# EAGLE design head-board (EAGLE 9.5.1)
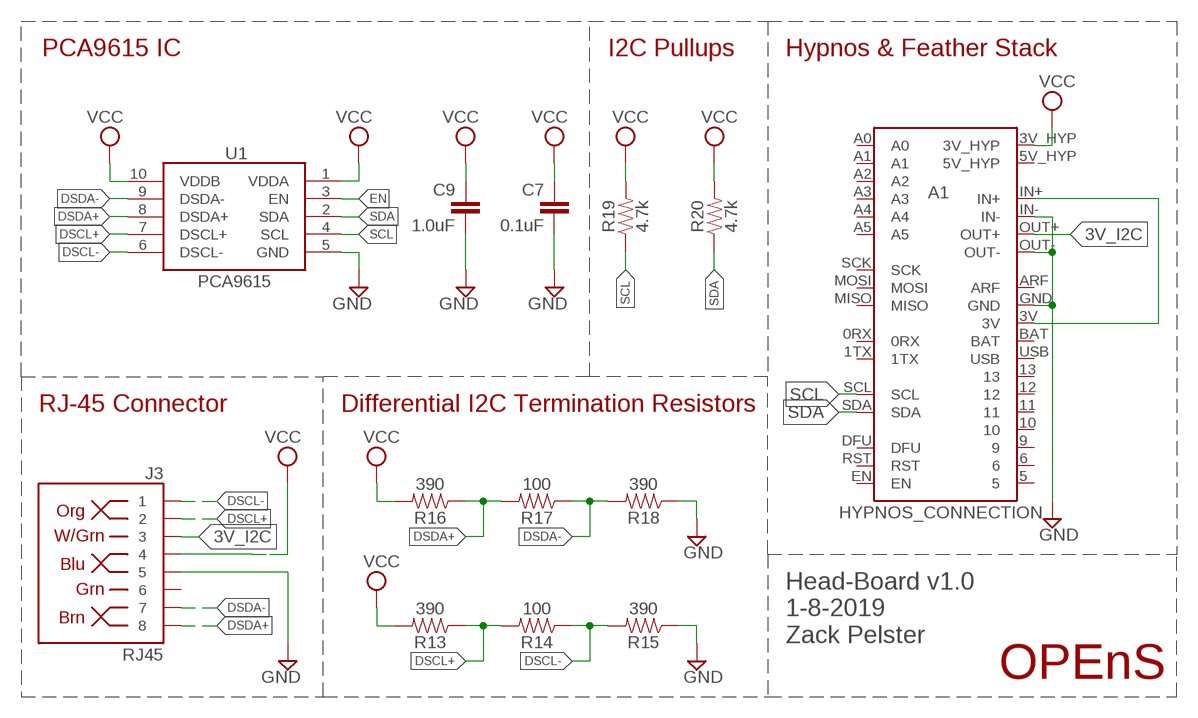
[diagram p0: schematic, sheet 1]

## Parts
A1  HYPNOS_CONNECTION  [HYPNOS_CONNECTION]
C7  0.1uF  0.1UF-0603-25V-(+80/-20%)  [0603]
C9  1.0uF  1.0UF-0603-16V-10%  [0603]
J3  RJ45  RJ45-8  [RJ45-8]
R13  390  390OHM-0603-1/10W-1%  [0603]
R14  100  100OHM-0603-1/10W-1%  [0603]
R15  390  390OHM-0603-1/10W-1%  [0603]
R16  390  390OHM-0603-1/10W-1%  [0603]
R17  100  100OHM-0603-1/10W-1%  [0603]
R18  390  390OHM-0603-1/10W-1%  [0603]
R19  4.7k  4.7KOHM-0603-1/10W-1%  [0603]
R20  4.7k  4.7KOHM-0603-1/10W-1%  [0603]
U1  PCA9615  [TSSOP10]
U$1  OPENS-LOGO  [OPENS-LOGO]

## Nets
3V_I2C: A1.OUT+ J3.3
DSCL+: J3.2 R13.1 R14.2 U1.7(DSCL+)
DSCL-: J3.1 R14.1 R15.2 U1.6(DSCL-)
DSDA+: J3.8 R16.1 R17.2 U1.8(DSDA+)
DSDA-: J3.7 R17.1 R18.2 U1.9(DSDA-)
EN: U1.3(EN)
GND: A1.GND A1.IN- A1.OUT- C7.2 C9.2 J3.5 R15.1 R18.1 U1.5(GND)
N$1: A1.3V A1.IN+
SCL: A1.SCL R19.1 U1.4(SCL)
SDA: A1.SDA R20.1 U1.2(SDA)
VCC: A1.3V_HYP C7.1 C9.1 J3.4 R13.2 R16.2 R19.2 R20.2 U1.1(VDDA) U1.10(VDDB)
Unconnected: A1.0RX A1.1TX A1.5 A1.5V_HYP A1.6 A1.9 A1.10 A1.11 A1.12 A1.13 A1.A0 A1.A1 A1.A2 A1.A3 A1.A4 A1.A5 A1.ARF A1.DFU A1.EN A1.MISO A1.MOSI A1.RST A1.SCK J3.6

## Notes on the sheet
- PCA9615 IC | I2C Pullups | Hypnos & Feather Stack
- RJ-45 Connector | Differential I2C Termination Resistors
- Head-Board v1.0
  1-8-2019
  Zack Pelster

## Power pins joined to a net without a drawn wire
BAT: A1.BAT
USB: A1.USB

## Library data of the parts
A1 = PNNL_Probe:HYPNOS_CONNECTION
C7 = SparkFun-Capacitors:0.1UF: 0.1µF ceramic capacitors A capacitor is a passive two-terminal electrical component used to store electrical energy temporarily in an electric field.; PROD_ID: CAP-00810
C9 = SparkFun-Capacitors:1.0UF: 1µF ceramic capacitors A capacitor is a passive two-terminal electrical component used to store electrical energy temporarily in an electric field.; PROD_ID: CAP-00868
J3 = SparkFun-Connectors:RJ45-8: RJ45 Jack - 8 pin Simple RJ45, 8-pin connection. Commonly used for Cat5, Cat5e, and Cat6 Ethernet cables. Here is the connector we sell at SparkFun: RJ45 8-Pin Connector <https://www.sparkfun.com/products/643> (PRT-00643) Datasheet <https://cdn.sparkfun.com/datasheets/Prototyping/04908.pdf> It is used on this SparkFun product: SparkFun RJ45 Breakout <https://www.sparkfun.com/products/716> (BOB-00716) Note, you may also be interested in the "MAGJACK" version of this. It is basically a RJ45 connector, but also has some status LEDs built into the connector housing. You can check that out in this library at the device named "MAGJACK.dev" and see these products online: RJ45 Ethernet MagJack-Compatible <https://www.sparkfun.com/products/8534> (PRT-08534) SparkFun RJ45 MagJack Breakout <https://www.sparkfun.com/products/13021> (BOB-13021); PROD_ID: CONN-08506; SF_ID: PRT-00643
R13 R15 R16 R18 = SparkFun-Resistors:390OHM: 390Ω resistor A resistor is a passive two-terminal electrical component that implements electrical resistance as a circuit element. Resistors act to reduce current flow, and, at the same time, act to lower voltage levels within circuits. - Wikipedia; PROD_ID: RES-07864
R14 R17 = SparkFun-Resistors:100OHM: 100Ω resistor A resistor is a passive two-terminal electrical component that implements electrical resistance as a circuit element. Resistors act to reduce current flow, and, at the same time, act to lower voltage levels within circuits. - Wikipedia; PROD_ID: RES-07863
R19 R20 = SparkFun-Resistors:4.7KOHM: 4.7kΩ resistor A resistor is a passive two-terminal electrical component that implements electrical resistance as a circuit element. Resistors act to reduce current flow, and, at the same time, act to lower voltage levels within circuits. - Wikipedia; PROD_ID: RES-07857
U1 = SparkFun-IC-Comms:PCA9615: Differential I2C Bus Buffer Datasheet <https://www.nxp.com/docs/en/data-sheet/PCA9615.pdf>; PROD_ID: IC-13899
U$1 = opens-logo:OPENS-LOGO: OPENS Lab Logo

## Net classes
0 default: width 0.305 mm

## Board
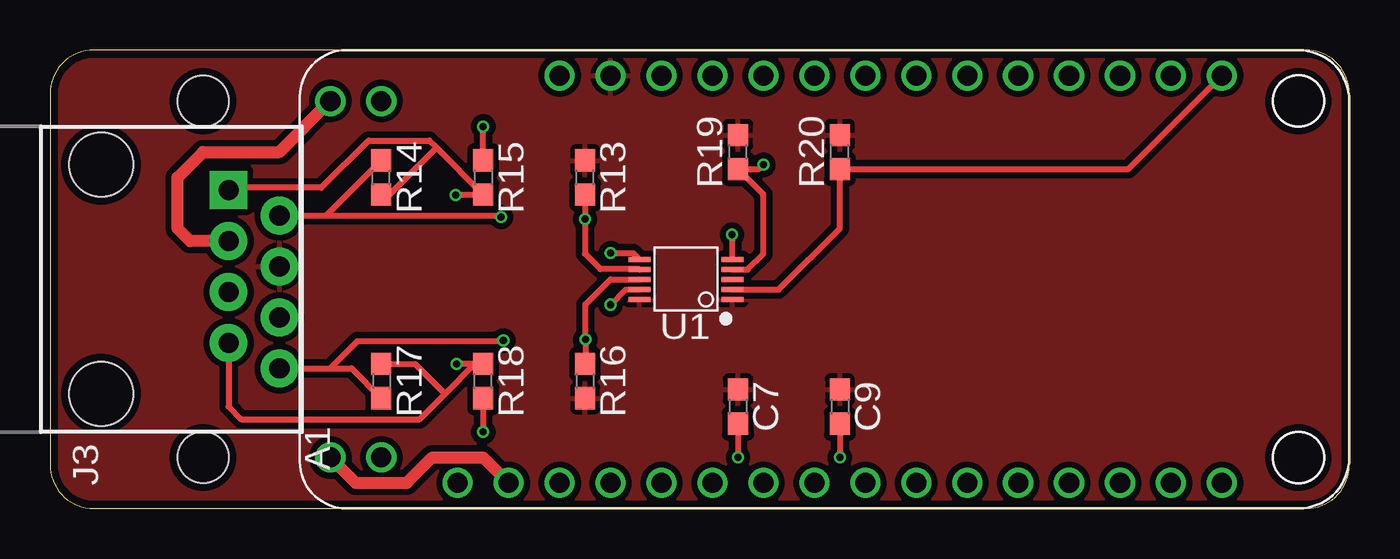
[diagram p1: board, top side]
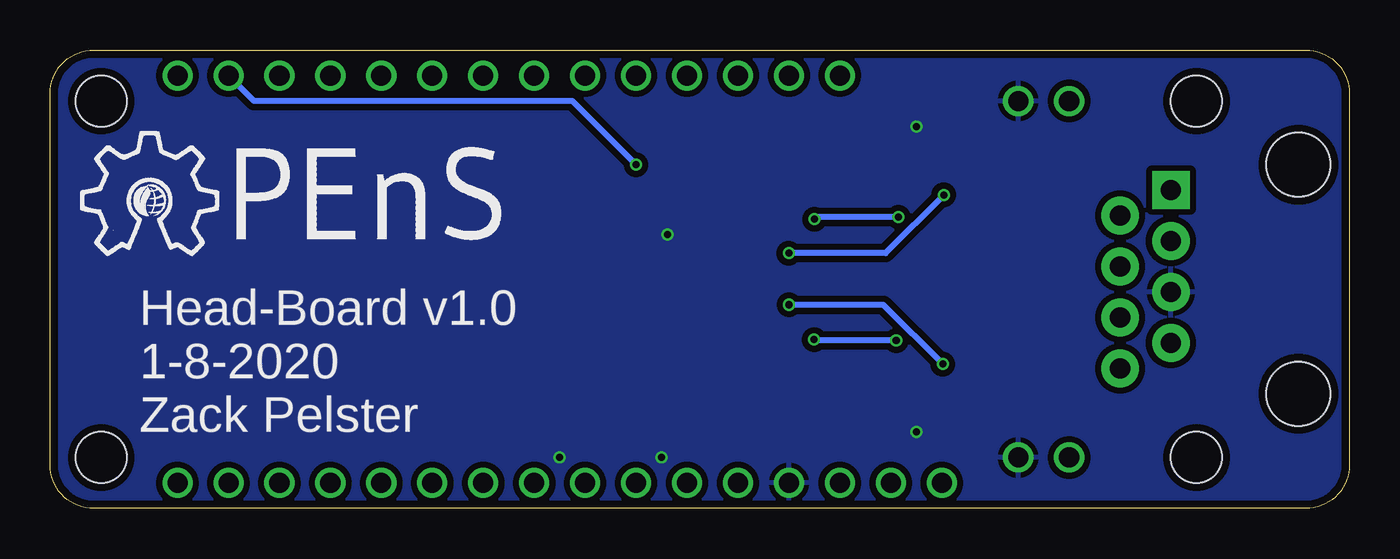
[diagram p2: board, bottom side, seen from below]

Size 64.77 x 22.86 mm. Coordinates in mm from the lower left corner, seen from the top.
Outline: 62.6,22.86 2.17,22.86 arc90 0,20.69 0,2.17 arc90 2.17,0 62.6,0 arc90 64.77,2.17 64.77,20.69 arc90 62.6,22.86
Copper layers (1*16): Top 0.035559375mm / dielectric 1.6mm / Bottom 0.035559375mm
Design rules "oshpark-2layer": minimum track width 6mil, minimum drill 10mil, track to track 6mil, track to pad 6mil, pad to pad 6mil, via to via 6mil, smd to smd 6mil, copper to edge 15mil, drill to drill 6mil, minimum pad ring 5mil, minimum via ring 5mil, stop-mask expansion 2.5mil, vias tented up to drill 0mil, thermal gap 10mil
Holes 2.54 mm at 7.62,20.32 7.62,2.54 62.23,2.54 62.23,20.32

### Footprints (pad centres in the part's own frame; a part is rotated, then mirrored left to right if it is on the bottom)
HYPNOS_CONNECTION = drill 1: 0RX 39.37,1.27; 1TX 41.91,1.27; 3V 8.89,1.27; 3V_HYP 13.97,21.59; 5 39.37,21.59; 5V_HYP 11.43,21.59; 6 36.83,21.59; 9 34.29,21.59; 10 31.75,21.59; 11 29.21,21.59; 12 26.67,21.59; 13 24.13,21.59; A0 16.51,1.27; A1 19.05,1.27; A2 21.59,1.27; A3 24.13,1.27; A4 26.67,1.27; A5 29.21,1.27; ARF 11.43,1.27; BAT 16.51,21.59; DFU 44.45,1.27; EN 19.05,21.59; GND 13.97,1.27; IN+ 0,2.54; IN- 2.54,2.54; MISO 36.83,1.27; MOSI 34.29,1.27; OUT+ 0,20.32; OUT- 2.54,20.32; RST 6.35,1.27; SCK 31.75,1.27; SCL 41.91,21.59; SDA 44.45,21.59; USB 21.59,21.59
0603 = smd 1.1 x 1: 1 -0.85,0; 2 0.85,0
RJ45-8 = drill 1 pad 1.88 square: 1 -4.445,6.35 | drill 1 pad 1.88: 2 -3.175,8.89; 3 -1.905,6.35; 4 -0.635,8.89; 5 0.635,6.35; 6 1.905,8.89; 7 3.175,6.35; 8 4.445,8.89 | hole 3.2: -5.715,0; 5.715,0
TSSOP10 = smd 1.1 x 0.25: 1 -2.259,1.018; 2 -2.259,0.517; 3 -2.259,0.018; 4 -2.259,-0.482; 5 -2.259,-0.988; 6 2.366,-0.988; 7 2.366,-0.482; 8 2.366,0.018; 9 2.366,0.517; 10 2.366,1.018

### Placement (x,y rotation side)
A1  13.97,0 0 top
C7  34.29,5.08 270 top
C9  39.37,5.08 270 top
J3  2.54,11.43 270 top
R13  26.67,16.51 90 top
R14  16.51,16.51 90 top
R15  21.59,16.51 270 top
R16  26.67,6.35 270 top
R17  16.51,6.35 270 top
R18  21.59,6.35 90 top
R19  34.29,17.78 90 top
R20  39.37,17.78 90 top
U1  31.75,11.43 180 top
U$1  63.5,8.89 0 bottom

### Tracks (layer width: path | path; a pad name or v marks a point on that pad's centre or on a via)
3V_I2C
  Top 0.61: J3.3 6.99,13.34 6.35,13.97 6.35,16.51 7.62,17.78 11.43,17.78 A1.OUT+
DSCL+  (via drill 0.35)
  Top 0.305: J3.2 13.76,14.61 13.77,14.62 | 13.77,14.62 R14.2 | R13.1 v26.66,14.43 26.66,12.71 27.44,11.93 29.36,11.93 U1.7 | v22.48,14.54 22.4,14.62 13.77,14.62
  Bottom 0.305: v22.48,14.54 26.56,14.54 v26.66,14.43
DSCL-  (via drill 0.35)
  Top 0.305: J3.1 9.01,15.99 13.52,15.99 15.88,18.36 18.89,18.36 19.26,17.99 | 19.26,17.99 R15.2 20.24,15.66 v20.22,15.63 | R14.1 16.93,15.66 19.26,17.99 | v27.94,12.73 29.07,12.73 U1.6
  Bottom 0.305: v20.22,15.63 23.12,12.73 v27.94,12.73
DSDA+  (via drill 0.35)
  Top 0.305: J3.8 13.97,6.99 | 13.97,6.99 15.03,6.99 R17.2 | 13.97,6.99 15.33,8.34 22.56,8.34 v22.59,8.37 | R16.1 26.69,7.21 v26.69,8.42 26.69,10.18 27.94,11.43 29.37,11.43 U1.8
  Bottom 0.305: v22.59,8.37 26.63,8.37 v26.69,8.42
DSDA-  (via drill 0.35)
  Top 0.305: J3.7 8.89,5.08 9.53,4.45 18.41,4.45 19.69,5.71 | 19.69,5.71 21.17,7.2 R18.2 v20.27,7.2 | R17.1 18.2,7.2 19.69,5.71 | v27.94,10.16 28.69,10.91 U1.9
  Bottom 0.305: v27.94,10.16 23.23,10.16 v20.27,7.2
GND  (via drill 0.35)
  Top 0.305: R15.1 v21.59,19.05 | R18.1 v21.59,3.81 | C7.2 v34.29,2.54 | C9.2 v39.37,2.54 | U1.5 v34.01,13.67 v34,13.66
  pour Bottom (isolate 0.305): -2.54,25.4 -2.54,-2.54 67.31,-2.54 67.31,25.4
N$1
  Top 0.61: A1.IN+ 15.24,1.27 17.78,1.27 19.05,2.54 21.59,2.54 A1.3V
SCL  (via drill 0.35)
  Top 0.305: U1.4 34.77,11.91 35.56,12.7 35.56,15.66 R19.1 35.34,16.93 v35.56,17.14
  Bottom 0.305: A1.SCL 54.61,20.32 38.73,20.32 v35.56,17.14
SDA
  Top 0.305: U1.2 36.31,10.91 39.37,13.97 R20.1 53.76,16.93 A1.SDA
VCC
  pour Top (isolate 0.305): -1.27,24.13 -1.27,-1.27 66.04,-1.27 66.04,24.13

### Text on the board
bPlace: Head-Board v1.0 / 1-8-2020 / Zack Pelster